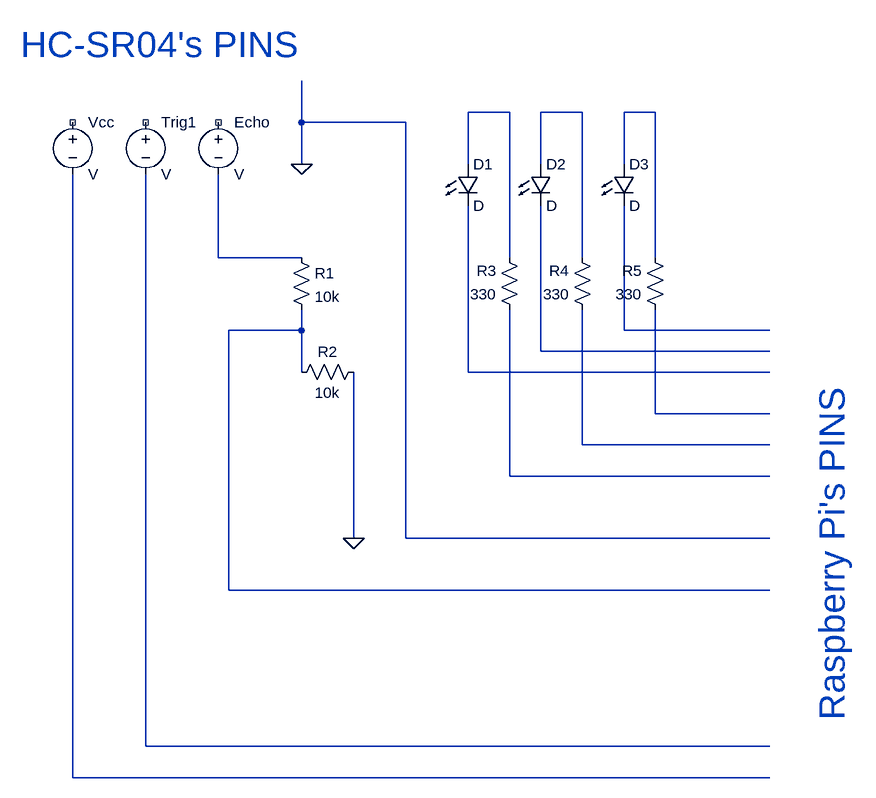
[diagram p0: schematic CircuitDraft.asc]
CircuitDraft.asc, the LTspice schematic file:
Version 4
SHEET 1 1060 964
WIRE 528 -64 464 -64
WIRE 640 -64 576 -64
WIRE 752 -64 704 -64
WIRE 208 -48 208 -112
WIRE 368 -48 208 -48
WIRE 208 16 208 -48
WIRE 464 16 464 -64
WIRE 576 16 576 -64
WIRE 704 16 704 -64
WIRE 80 160 80 32
WIRE 208 160 80 160
WIRE 528 160 528 -64
WIRE 640 160 640 -64
WIRE 752 160 752 -64
WIRE 208 272 208 240
WIRE 208 272 96 272
WIRE 704 272 704 80
WIRE 928 272 704 272
WIRE 576 304 576 80
WIRE 928 304 576 304
WIRE 208 336 208 272
WIRE 464 336 464 80
WIRE 928 336 464 336
WIRE 752 400 752 240
WIRE 928 400 752 400
WIRE 640 448 640 240
WIRE 928 448 640 448
WIRE 528 496 528 240
WIRE 928 496 528 496
WIRE 288 592 288 336
WIRE 368 592 368 -48
WIRE 928 592 368 592
WIRE 96 672 96 272
WIRE 928 672 96 672
WIRE -32 912 -32 32
WIRE 928 912 -32 912
WIRE -144 960 -144 32
WIRE 928 960 -144 960
FLAG 288 592 0
FLAG 208 16 0
SYMBOL res 192 144 R0
SYMATTR InstName R1
SYMATTR Value 10k
SYMBOL res 304 320 R90
WINDOW 0 0 56 VBottom 2
WINDOW 3 32 56 VTop 2
SYMATTR InstName R2
SYMATTR Value 10k
SYMBOL res 544 256 R180
WINDOW 0 36 76 Left 2
WINDOW 3 36 40 Left 2
SYMATTR InstName R3
SYMATTR Value 330
SYMBOL res 656 256 R180
WINDOW 0 36 76 Left 2
WINDOW 3 36 40 Left 2
SYMATTR InstName R4
SYMATTR Value 330
SYMBOL res 768 256 R180
WINDOW 0 36 76 Left 2
WINDOW 3 36 40 Left 2
SYMATTR InstName R5
SYMATTR Value 330
SYMBOL LED 448 16 R0
SYMATTR InstName D1
SYMBOL LED 560 16 R0
SYMATTR InstName D2
SYMBOL LED 688 16 R0
SYMATTR InstName D3
SYMBOL voltage -32 -64 R0
SYMATTR InstName Trig1
SYMBOL voltage 80 -64 R0
SYMATTR InstName Echo
SYMBOL voltage -144 -64 R0
SYMATTR InstName Vcc
TEXT -224 -168 Left 5 ;HC-SR04's PINS
TEXT 1024 872 VLeft 5 ;Raspberry Pi's PINS

The netlist it stands for:
* CircuitDraft.asc
R1 N004 N005 10k
R2 0 N005 10k
R3 N011 N001 330
R4 N010 N002 330
R5 N009 N003 330
D1 N001 N008 D
D2 N002 N007 D
D3 N003 N006 D
V§Trig1 NC_01 N012 V
V§Echo NC_02 N004 V
Vcc NC_03 N013 V
.model D D
.lib standard.dio
* HC-SR04's PINS
* Raspberry Pi's PINS
.backanno
.end